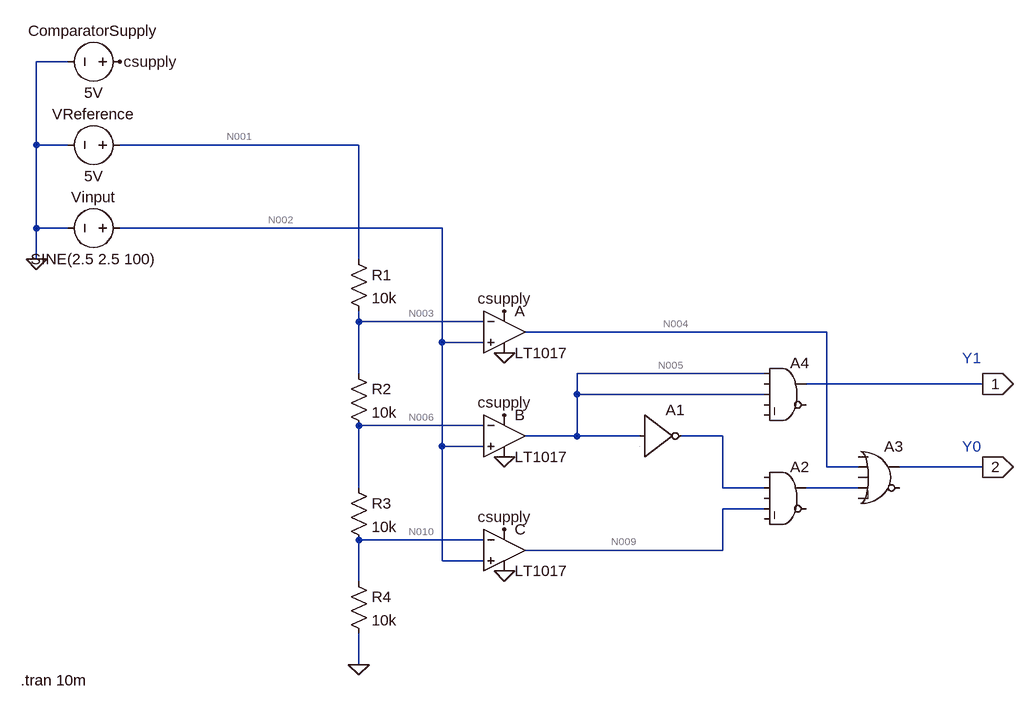
[diagram p0: schematic Adc.asc]
Adc.asc, the LTspice schematic file:
Version 4
SHEET 1 1464 680
WIRE -368 -288 -416 -288
WIRE -416 -160 -416 -288
WIRE -368 -160 -416 -160
WIRE 80 -160 -288 -160
WIRE -416 -32 -416 -160
WIRE -368 -32 -416 -32
WIRE 208 -32 -288 -32
WIRE -416 16 -416 -32
WIRE 80 16 80 -160
WIRE 80 112 80 96
WIRE 272 112 80 112
WIRE 800 128 336 128
WIRE 208 144 208 -32
WIRE 272 144 208 144
WIRE 80 192 80 112
WIRE 704 192 416 192
WIRE 1040 208 768 208
WIRE 416 224 416 192
WIRE 704 224 416 224
WIRE 272 272 80 272
WIRE 416 288 416 224
WIRE 416 288 336 288
WIRE 512 288 416 288
WIRE 640 288 576 288
WIRE 208 304 208 144
WIRE 272 304 208 304
WIRE 800 336 800 128
WIRE 848 336 800 336
WIRE 1040 336 912 336
WIRE 80 368 80 272
WIRE 640 368 640 288
WIRE 704 368 640 368
WIRE 848 368 768 368
WIRE 704 400 640 400
WIRE 272 448 80 448
WIRE 640 464 640 400
WIRE 640 464 336 464
WIRE 208 480 208 304
WIRE 272 480 208 480
WIRE 80 512 80 448
WIRE 80 640 80 592
FLAG 80 640 0
FLAG -416 16 0
FLAG 304 160 0
FLAG 304 320 0
FLAG 304 496 0
FLAG -288 -288 csupply
FLAG 304 96 csupply
FLAG 304 256 csupply
FLAG 304 432 csupply
FLAG 1040 208 1
IOPIN 1040 208 Out
FLAG 1040 336 2
IOPIN 1040 336 Out
SYMBOL res 64 0 R0
SYMATTR InstName R1
SYMATTR Value 10k
SYMBOL res 64 176 R0
SYMATTR InstName R2
SYMATTR Value 10k
SYMBOL res 64 352 R0
SYMATTR InstName R3
SYMATTR Value 10k
SYMBOL res 64 496 R0
SYMATTR InstName R4
SYMATTR Value 10k
SYMBOL Comparators\\LT1017 304 128 R0
SYMATTR InstName A
SYMBOL Comparators\\LT1017 304 288 R0
SYMATTR InstName B
SYMBOL Comparators\\LT1017 304 464 R0
SYMATTR InstName C
SYMBOL voltage -272 -288 R90
WINDOW 0 -32 56 VBottom 2
WINDOW 3 32 56 VTop 2
WINDOW 123 0 0 Left 0
WINDOW 39 0 0 Left 0
SYMATTR InstName ComparatorSupply
SYMATTR Value 5V
SYMBOL voltage -272 -160 R90
WINDOW 0 -32 56 VBottom 2
WINDOW 3 32 56 VTop 2
WINDOW 123 0 0 Left 0
WINDOW 39 0 0 Left 0
SYMATTR InstName VReference
SYMATTR Value 5V
SYMBOL voltage -272 -32 R90
WINDOW 0 -32 56 VBottom 2
WINDOW 3 32 56 VTop 2
WINDOW 123 0 0 Left 0
WINDOW 39 0 0 Left 0
SYMATTR InstName Vinput
SYMATTR Value SINE(2.5 2.5 100)
SYMBOL Digital\\inv 512 224 R0
SYMATTR InstName A1
SYMBOL Digital\\and 736 320 R0
SYMATTR InstName A2
SYMBOL Digital\\or 880 288 R0
SYMATTR InstName A3
SYMBOL Digital\\and 736 160 R0
SYMATTR InstName A4
TEXT -440 664 Left 2 !.tran 10m
TEXT 1008 168 Left 2 ;Y1
TEXT 1008 304 Left 2 ;Y0

The netlist it stands for:
* Adc.asc
R1 N001 N003 10k
R2 N003 N006 10k
R3 N006 N010 10k
R4 N010 0 10k
XA N002 N003 csupply 0 N004 LT1017  ; pins In+ In- V+ V- OUT
XB N002 N006 csupply 0 N005 LT1017  ; pins In+ In- V+ V- OUT
XC N002 N010 csupply 0 N009 LT1017  ; pins In+ In- V+ V- OUT
V§ComparatorSupply csupply 0 5V
VReference N001 0 5V
Vinput N002 0 SINE(2.5 2.5 100)
A1 N005 0 0 0 0 N007 0 0 BUF
A2 0 N007 0 N009 0 0 N008 0 AND
A3 0 N004 0 N008 0 0 2 0 OR
A4 N005 0 N005 0 0 0 1 0 AND
.tran 10m
* Y1
* Y0
.backanno
.end

* Results of the author's LTspice run, read from the files saved beside the schematic
* Operating Point, zero values left out:
*   V(n001) = 5 V
*   V(n003) = 3.75 V
*   V(n006) = 2.5 V
*   V(n010) = 1.25 V
*   V(csupply) = 5 V
*   V(n004) = 48.4 mV
*   V(n002) = 2.5 V
*   V(n005) = 4.96 V
*   V(n009) = 4.96 V
*   V(1) = 1 V
*   I(R4) = 125 µA
*   I(R3) = 125 µA
*   I(R2) = 125 µA
*   I(R1) = 125 µA
*   I(Vinput) = -9.303 nA
*   I(Vreference) = -125 µA
*   I(Comparatorsupply) = -350.1 µA
*   Ix(a:1) = 100 pA
*   Ix(a:2) = 6.1 nA
*   Ix(a:3) = 107 µA
*   Ix(a:4) = -107 µA
*   Ix(a:5) = 4.912 pA
*   Ix(b:1) = 3.103 nA
*   Ix(b:2) = 3.097 nA
*   Ix(b:3) = 121.5 µA
*   Ix(b:4) = -121.5 µA
*   Ix(b:5) = -4.912 pA
*   Ix(c:1) = 6.1 nA
*   Ix(c:2) = 100 pA
*   Ix(c:3) = 121.5 µA
*   Ix(c:4) = -121.5 µA
*   Ix(c:5) = -4.912 pA
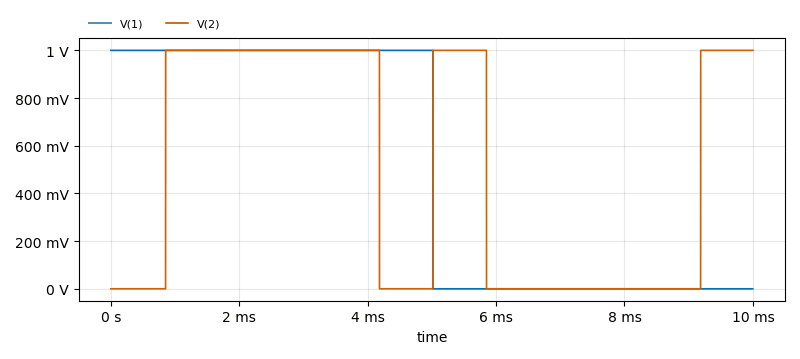
[diagram p1: Transient Analysis of Adc.asc, plotted from the saved traces]
* Transient Analysis, 1 run:
*   V(1): min 0 V, max 1 V, average 501.6 mV, rms 708.2 mV, last 0 V
*   V(2): min 0 V, max 1 V, average 497.9 mV, rms 705.6 mV, last 1 V